# EAGLE design Antennae0.1 (EAGLE 7.3.0)
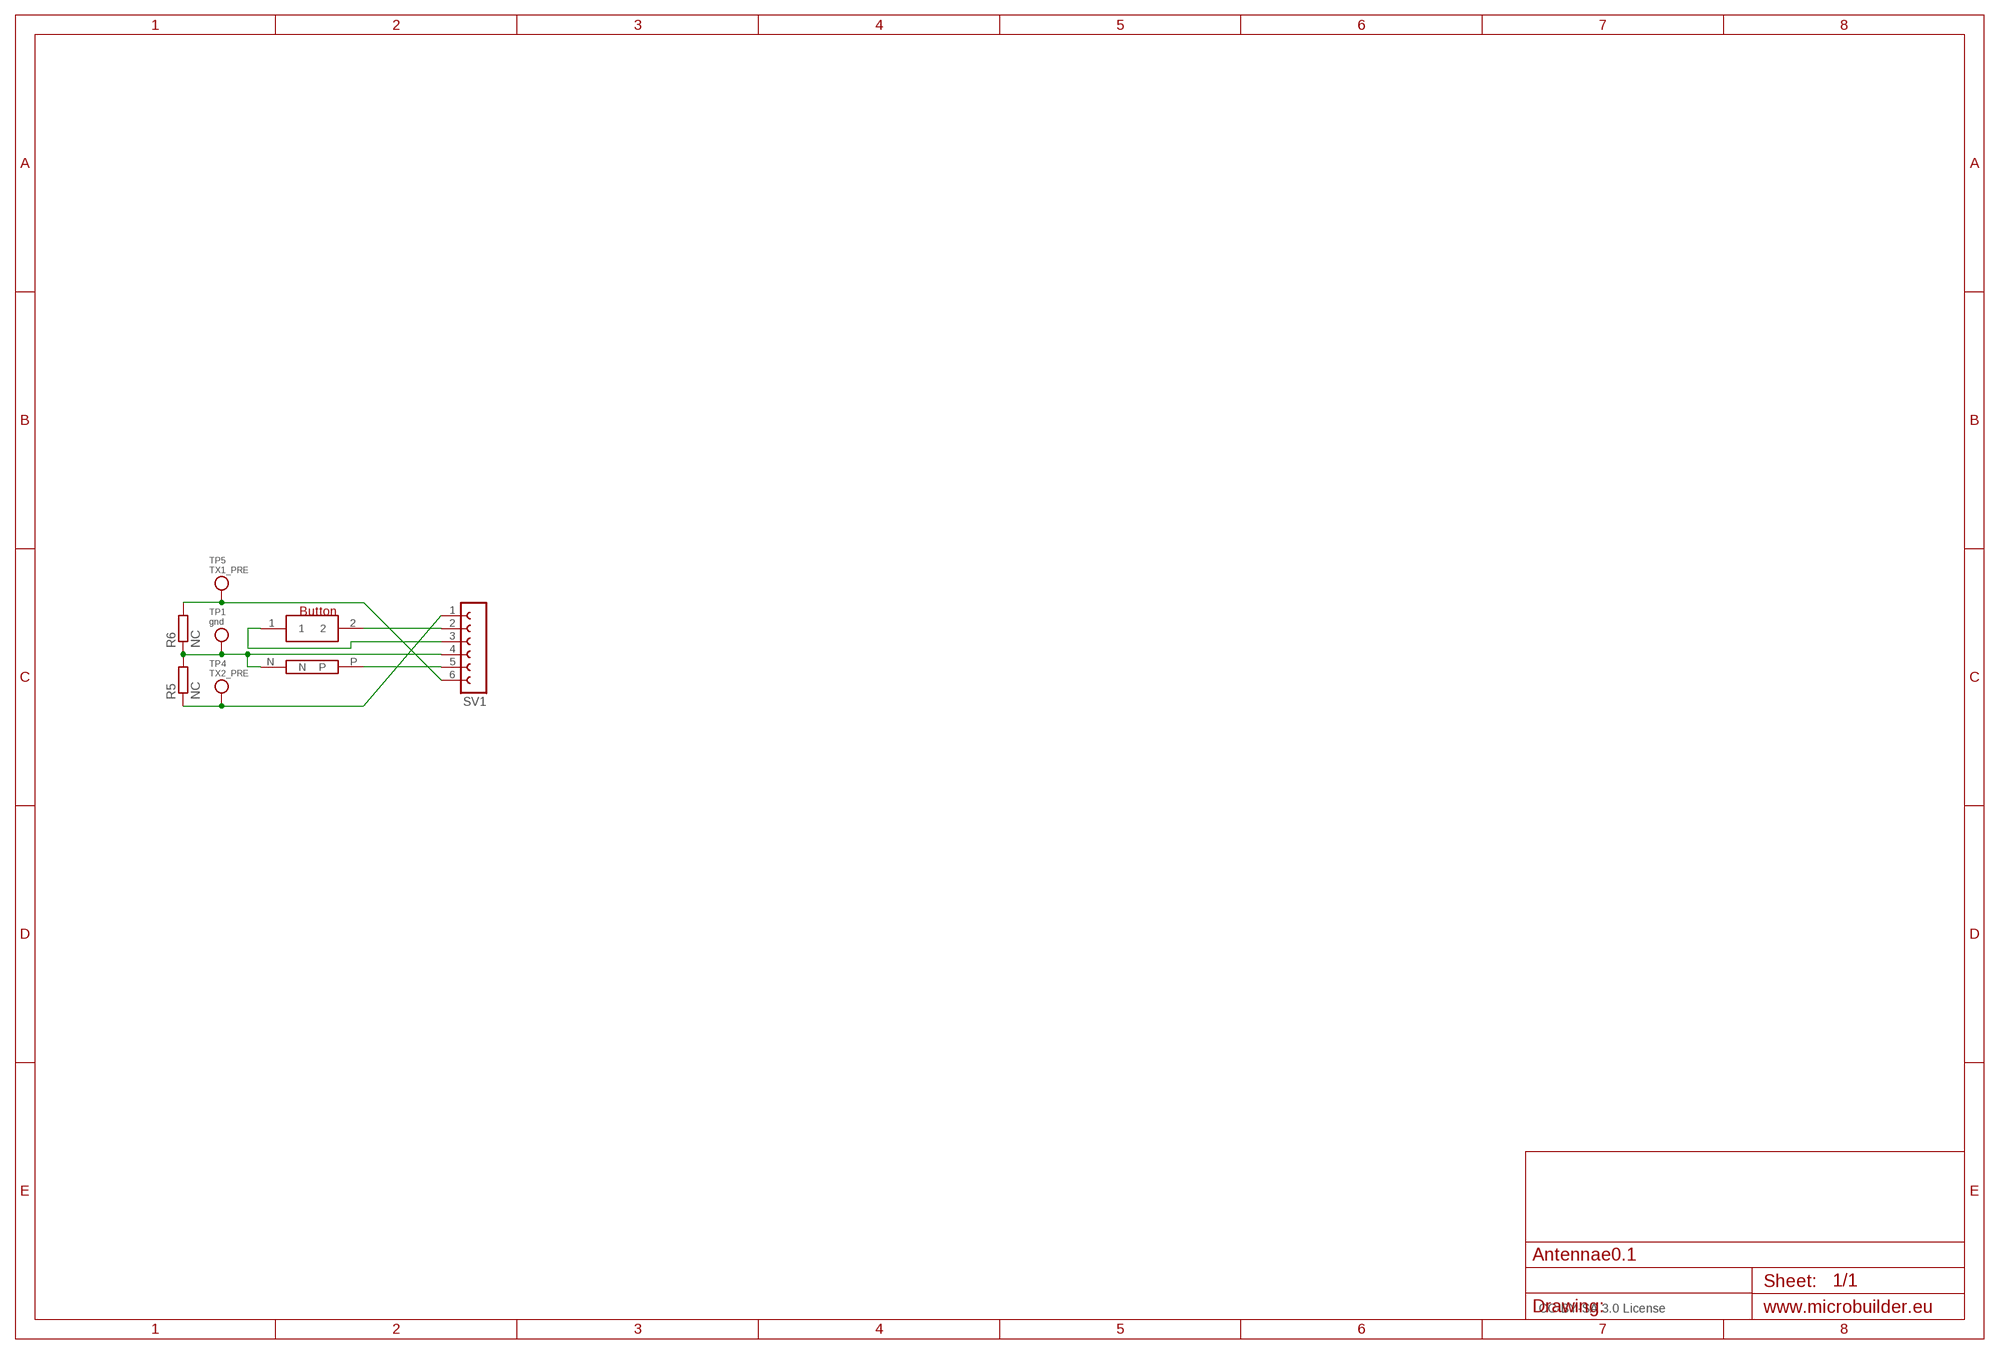
[diagram p0: schematic, sheet 1]

## Parts
R5  NC  R-EU_R0201  [R0201]
R6  NC  R-EU_R0201  [R0201]
SV1  FE06-1  [FE06]
TP1  gnd  TESTPOINTPAD  [TESTPOINT_PAD_2MM]
TP4  TX2_PRE  TESTPOINTPAD  [TESTPOINT_PAD_2MM]
TP5  TX1_PRE  TESTPOINTPAD  [TESTPOINT_PAD_2MM]
U$1  BUTTON  [BUTTON]
U$2  LED(805)  [LED(805)]

## Nets
N$1: SV1.2 U$1.2
N$2: SV1.5 U$2.P
N$4: R6.2 SV1.6 TP5.P$1
N$5: R5.1 SV1.1 TP4.P$1
N$30: R5.2 R6.1 SV1.4 TP1.P$1 U$2.N
VCC: SV1.3 U$1.1

## Notes on the sheet
- CC-BY-SA 3.0 License

## Library data of the parts
R5 R6 = rcl:R-EU_: RESISTOR, European symbol
SV1 = con-lsta:FE06-1: FEMALE HEADER; OC_FARNELL: unknown; OC_NEWARK: unknown
TP1 TP4 TP5 = microbuilder:TESTPOINT: Test Point TESTPOINT_SMT - Compact Surface Mount Test Point [Digikey: 5016KTR-ND] TESTPOINT_PAD - Square Pad (2mm) TESTPOINT_SMT - Round Pad (2mm) TESTPOINT_0.1" - 0.1" Header
U$1 = Tarun:BUTTON
U$2 = Tarun:LED(805)

## Board
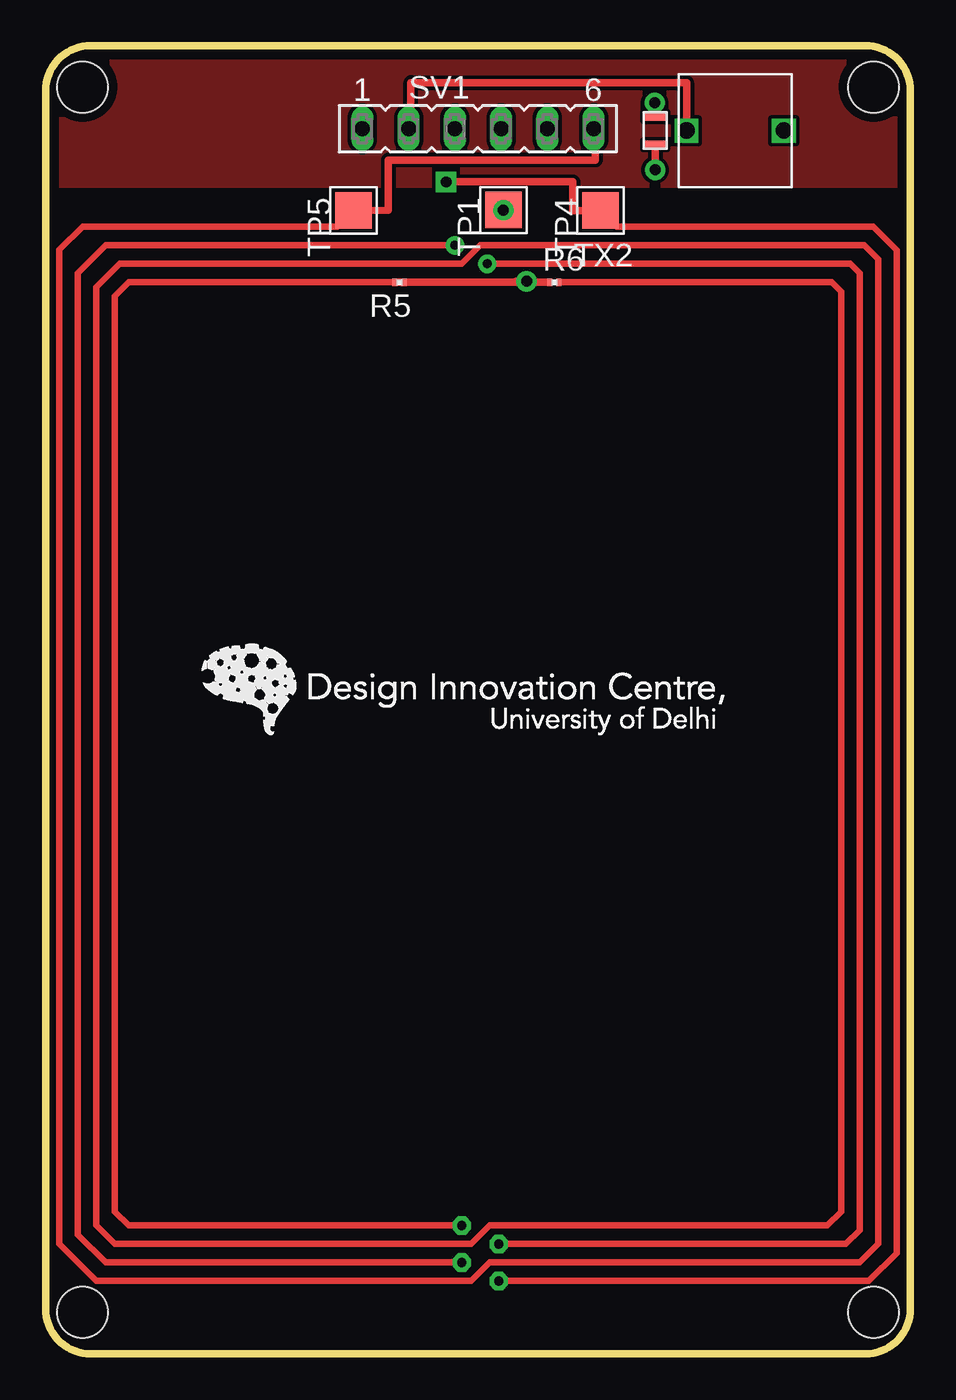
[diagram p1: board, top side]
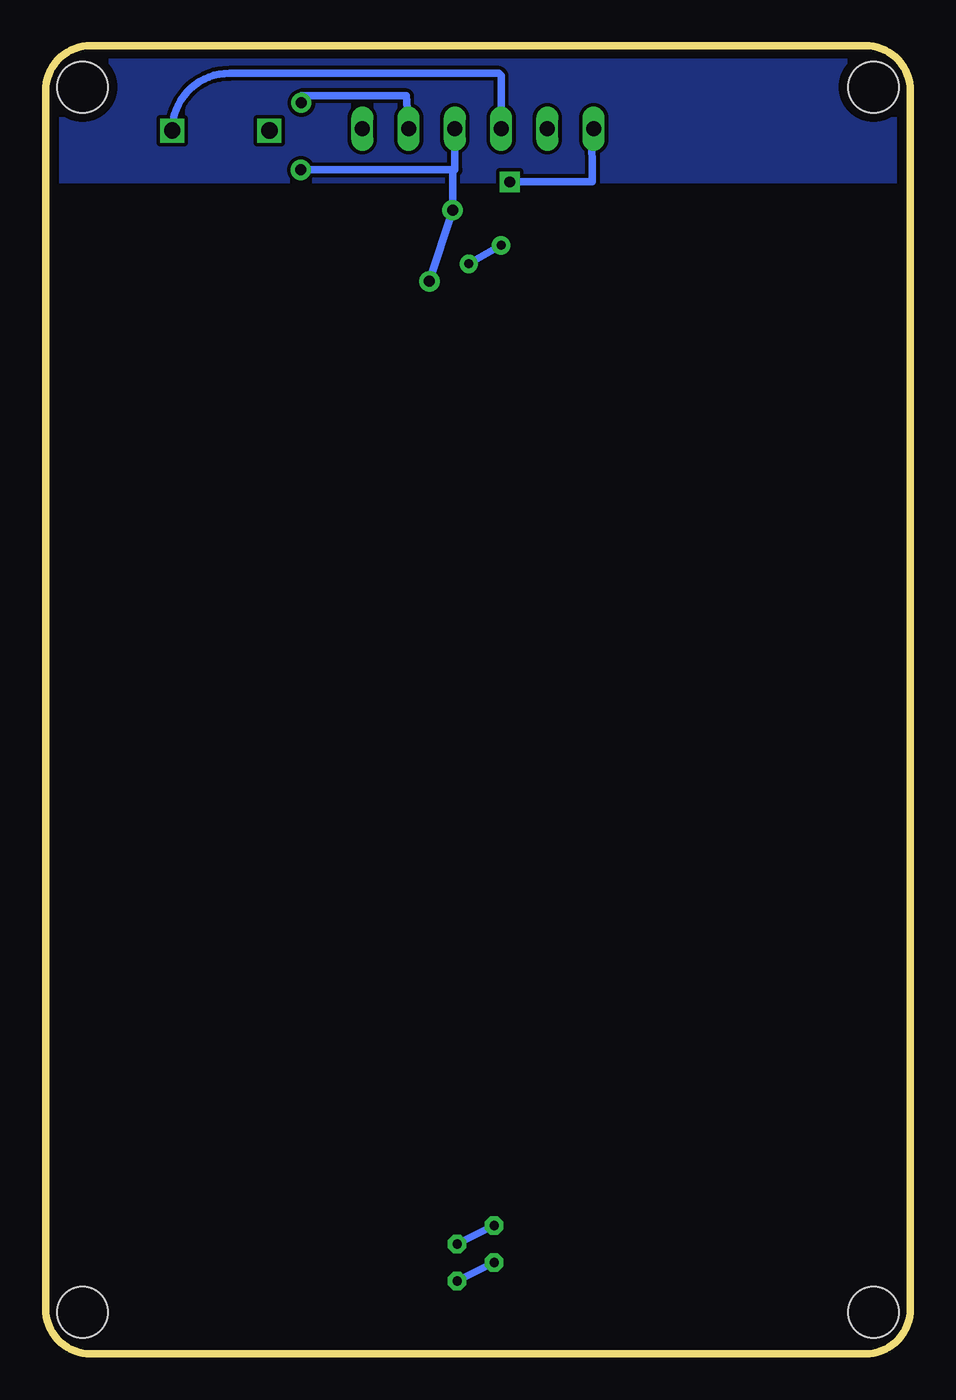
[diagram p2: board, bottom side, seen from below]

Size 47.5 x 71.88 mm. Coordinates in mm from the lower left corner, seen from the top.
Outline: 45,0 arc90 47.5,2.5 47.5,69.38 arc90 45,71.88 2.5,71.88 arc90 0,69.38 0,2.5 arc90 2.5,0
Outline: 2.5,0 44.98,0
Copper layers (1*16): Top 0.035mm / dielectric 1.5mm / Bottom 0.035mm
Design rules "PCBCart-Standard": minimum track width 8mil, minimum drill 0.4mm, track to track 8mil, track to pad 8mil, pad to pad 8mil, via to via 8mil, smd to smd 8mil, copper to edge 20mil, drill to drill 8mil, minimum pad ring 8mil, minimum via ring 10mil, stop-mask expansion 3mil, vias tented up to drill 0mil, thermal gap 8mil
Holes 2.8 mm at 2.03,69.6 45.47,69.6 2.03,2.29 45.47,2.29
bRestrict: area 20.8,2.7 to 22.1,7.8; area 25.7,2.7 to 26.9,7.8; area 4.8,8.3 to 42.7,57.6

### Footprints (pad centres in the part's own frame; a part is rotated, then mirrored left to right if it is on the bottom)
R0201 = smd 0.28 x 0.43: 1 -0.255,0; 2 0.255,0
FE06 = drill 0.813 long: 1 -6.35,0; 2 -3.81,0; 3 -1.27,0; 4 1.27,0; 5 3.81,0; 6 6.35,0
TESTPOINT_PAD_2MM = smd 2 x 2: P$1 0,0
BUTTON = drill 0.9 square: 1 -2.667,0; 2 2.667,0
LED(805) = smd 0.45 x 1.25: N 0.775,0; P -0.775,0

### Placement (x,y rotation side)
R5  19.43,58.87 180 top
R6  27.94,58.87 0 top
SV1  23.75,67.31 0 top
TP1  25.15,62.84 90 top
TP4  30.48,62.82 90 top
TP5  16.91,62.82 90 top
U$1  37.87,67.21 180 top
U$2  33.48,67.21 270 top

### Tracks (layer width: path | path; a pad name or v marks a point on that pad's centre or on a via)
N$1
  Top 0.406: SV1.2 20.07,67.31 20.07,69.85 35.2,69.85 U$1.2
N$2  (via drill 0.6)
  Top 0.406: v33.45,68.73 33.48,68.73 U$2.P
  Bottom 0.406: SV1.5 27.69,69.11 33.45,69.11 v33.45,68.73
N$3
  pour Bottom: 44.74,71.63 2.75,71.63 arc90 0.25,69.13 0.25,64.52 47.24,64.52 47.24,69.13 arc90
N$4
  Top 0.356: TP5.P$1 16.02,61.93 2.03,61.93 0.76,60.66 0.76,6.04 2.79,4.01 23.37,4.01 24.38,5.02 44.7,5.02 45.72,6.04 45.72,60.14 44.96,60.9 23.88,60.9 22.86,59.89 4.06,59.89 2.79,58.62 2.79,7.06 3.81,6.04 23.37,6.04 24.38,7.06 42.93,7.06 43.69,7.82 43.69,58.36 43.18,58.87 R6.2
  Top 0.406: TP5.P$1 18.83,62.84 18.82,63.72 18.82,65.58 30.2,65.58 30.2,67.31 SV1.6
N$5  (via drill 0.5, 0.6)
  Top 0.356: v24.89,4.01 45.21,4.01 46.74,5.53 46.74,60.65 45.46,61.93 31.37,61.93 TP4.P$1 | v22.86,5.02 3.3,5.02 1.78,6.55 1.78,59.38 3.3,60.9 v22.48,60.9 | v24.26,59.89 44.2,59.89 44.7,59.38 44.7,6.8 43.94,6.04 v24.89,6.04 | v22.86,7.06 4.57,7.06 3.81,7.82 3.81,58.11 4.57,58.87 R5.1 19.81,58.87
  Top 0.406: 30.35,62.69 TP4.P$1 arc-90 TP4.P$1 28.96,62.81 28.96,64.39 v22,64.39
  Bottom 0.406: v22.86,5.02 v24.89,4.01 | v22.48,60.9 v24.26,59.89 | v24.89,6.04 v22.86,7.06 | SV1.1 17.5,67.31 17.48,64.39 v22,64.39
N$6
  pour Top: 0.76,71.12 0.76,64.26 46.74,64.26 46.74,71.12
N$30  (via drill 0.6)
  Top 0.406: R5.2 R6.1 25.85,58.93 v26.42,58.93 | U$2.N v33.48,65.05
  Bottom 0.406: v26.42,58.93 TP1.P$1 25.15,65.05 | v33.48,65.05 25.15,65.05 | 25.15,65.05 25.02,65.05 SV1.4
  other vias: 25.15,62.84
VCC
  Bottom 0.406: SV1.3 22.48,70.23 22.61,70.36 37.39,70.36 arc-90 U$1.1

### Text on the board
tPlace: TX2